# Altium schematic sheet SLT3-PAY-1Q2T_P3.SchDoc
size A4
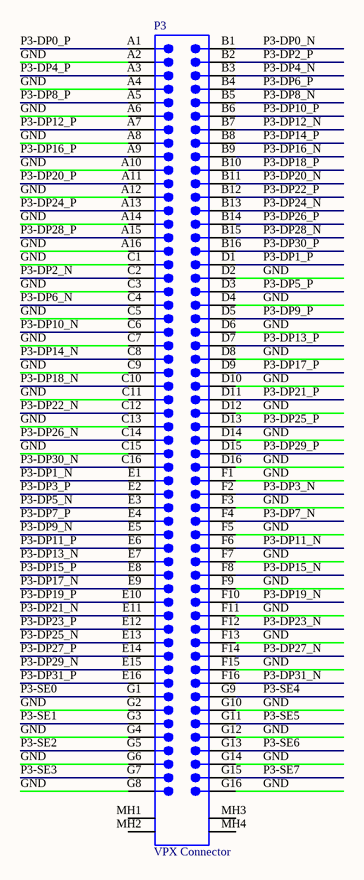
[diagram p0: SLT3-PAY-1Q2T_P3.SchDoc]

## Parts
P3  VPX Connector  [BTB1-8-4H112M]

## Nets
GND: P3.A2 P3.A4 P3.A6 P3.A8 P3.A10 P3.A12 P3.A14 P3.A16 P3.C1 P3.C3 P3.C5 P3.C7 P3.C9 P3.C11 P3.C13 P3.C15 P3.D2 P3.D4 P3.D6 P3.D8 P3.D10 P3.D12 P3.D14 P3.D16 P3.F1 P3.F3 P3.F5 P3.F7 P3.F9 P3.F11 P3.F13 P3.F15 P3.G2 P3.G4 P3.G6 P3.G8 P3.G10 P3.G12 P3.G14 P3.G16
P3-DP0_N: P3.B1
P3-DP0_P: P3.A1
P3-DP1_N: P3.E1
P3-DP1_P: P3.D1
P3-DP2_N: P3.C2
P3-DP2_P: P3.B2
P3-DP3_N: P3.F2
P3-DP3_P: P3.E2
P3-DP4_N: P3.B3
P3-DP4_P: P3.A3
P3-DP5_N: P3.E3
P3-DP5_P: P3.D3
P3-DP6_N: P3.C4
P3-DP6_P: P3.B4
P3-DP7_N: P3.F4
P3-DP7_P: P3.E4
P3-DP8_N: P3.B5
P3-DP8_P: P3.A5
P3-DP9_N: P3.E5
P3-DP9_P: P3.D5
P3-DP10_N: P3.C6
P3-DP10_P: P3.B6
P3-DP11_N: P3.F6
P3-DP11_P: P3.E6
P3-DP12_N: P3.B7
P3-DP12_P: P3.A7
P3-DP13_N: P3.E7
P3-DP13_P: P3.D7
P3-DP14_N: P3.C8
P3-DP14_P: P3.B8
P3-DP15_N: P3.F8
P3-DP15_P: P3.E8
P3-DP16_N: P3.B9
P3-DP16_P: P3.A9
P3-DP17_N: P3.E9
P3-DP17_P: P3.D9
P3-DP18_N: P3.C10
P3-DP18_P: P3.B10
P3-DP19_N: P3.F10
P3-DP19_P: P3.E10
P3-DP20_N: P3.B11
P3-DP20_P: P3.A11
P3-DP21_N: P3.E11
P3-DP21_P: P3.D11
P3-DP22_N: P3.C12
P3-DP22_P: P3.B12
P3-DP23_N: P3.F12
P3-DP23_P: P3.E12
P3-DP24_N: P3.B13
P3-DP24_P: P3.A13
P3-DP25_N: P3.E13
P3-DP25_P: P3.D13
P3-DP26_N: P3.C14
P3-DP26_P: P3.B14
P3-DP27_N: P3.F14
P3-DP27_P: P3.E14
P3-DP28_N: P3.B15
P3-DP28_P: P3.A15
P3-DP29_N: P3.E15
P3-DP29_P: P3.D15
P3-DP30_N: P3.C16
P3-DP30_P: P3.B16
P3-DP31_N: P3.F16
P3-DP31_P: P3.E16
P3-SE0: P3.G1
P3-SE1: P3.G3
P3-SE2: P3.G5
P3-SE3: P3.G7
P3-SE4: P3.G9
P3-SE5: P3.G11
P3-SE6: P3.G13
P3-SE7: P3.G15

Not connected (* = marked no-connect by the designer): P3 MH1 MH2 MH3 MH4

## Library data of the parts
P3 = 2102771-1: Ruggedized Board-to-Board Connector, Right Angle, 7-Row, Pitch 1.8mm, 112-Position; Manufacturer: TE; Bonding: No; ComponentHeigth: 14.7mm; PressFit: No; Case: *; Component Kind: Standard; Component Type: Standard; CreateDate: 2018-01-01; Device: *; Footprint: *; HelpURL: *; LatestRevisionDate: 2018-01-01; Manufacturer Part Number: 2102771-1; Mounted: Yes; PackageDescription: 2102771-1; Part Description: Ruggedized Board-to-Board Connector, Right Angle, 7-Row, Pitch 1.8mm, 112-Position; Part Number: 2102771-1; Pin Count: *; Sense: No; SMD: Yes; Socket: No; Family: VPX Connector